# Altium schematic sheet Servos.SchDoc: Servos
size A4; Date: 2022 Fall; Address1: LK Bulls; Address2: Bagoly Zoltan; Address3: Feher Daniel; Address4: G. Varga Gabor; DocumentNumber: 6; Revision: 1.0; SheetNumber: 6; SheetTotal: 14
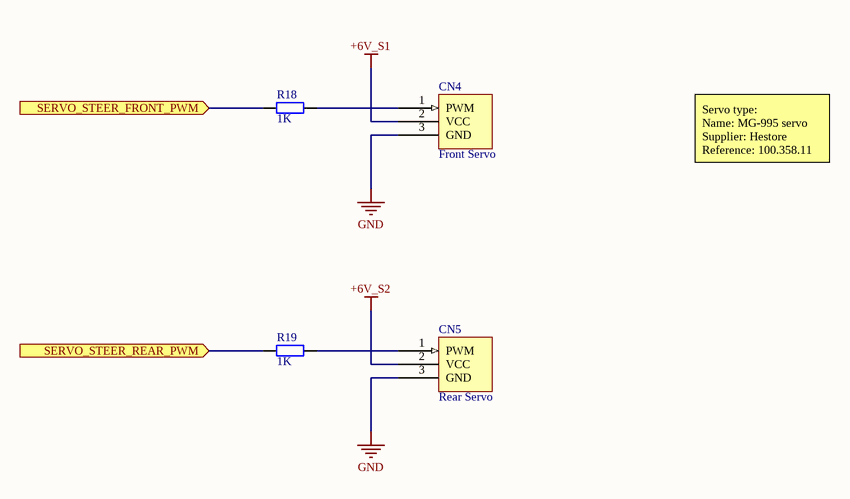
[diagram p0: Servos.SchDoc]

## Parts
CN4  Front Servo  [FP_CONN3_TUSKE_254MM]
CN5  Rear Servo  [FP_CONN3_TUSKE_254MM]
R18  1K  [FP_0805_RES]
R19  1K  [FP_0805_RES]

## Ports
SERVO_STEER_FRONT_PWM (in), SERVO_STEER_REAR_PWM (in)

## Nets
+6V_S1: CN4.2(VCC)
+6V_S2: CN5.2(VCC)
GND: CN4.3(GND) CN5.3(GND)
SERVO_STEER_FRONT_PWM: R18.1 ; port SERVO_STEER_FRONT_PWM
SERVO_STEER_REAR_PWM: R19.1 ; port SERVO_STEER_REAR_PWM
NetCN4_1: CN4.1(PWM) R18.2
NetCN5_1: CN5.1(PWM) R19.2

## Notes on the sheet
- Servo type:
  Name: MG-995 servo
  Supplier: Hestore
  Reference: 100.358.11
- Title
- Size:
- Date:
- A4
- Number:
- Revision:
- Sheet
- of
- Designed by:
- File:

## Library data of the parts
CN4 CN5 = Connector_servo: Steering servo / MG-995 servo; Name: TÜSKESOR 40 P PHSS-40- 6/3 (T-T) 2.54mm PIN 0.64x0.64 TÖRDELHETÖ; Supplier: Lomex; Reference: 43-00-73
R18 R19 = RES: Resistor; Tolerance: 5%; Power: 0.125W; Name: 1K00 0805 5% CR-05JL7----1K 0.125W (VIK); Supplier: Lomex; Reference: 81-10-87; Value: 1K